# Altium project ElectrisenseAnalogConditioningBoard (Hank Herman's conflicted copy 2011-05-26).PrjPcb (part 5 of 5)
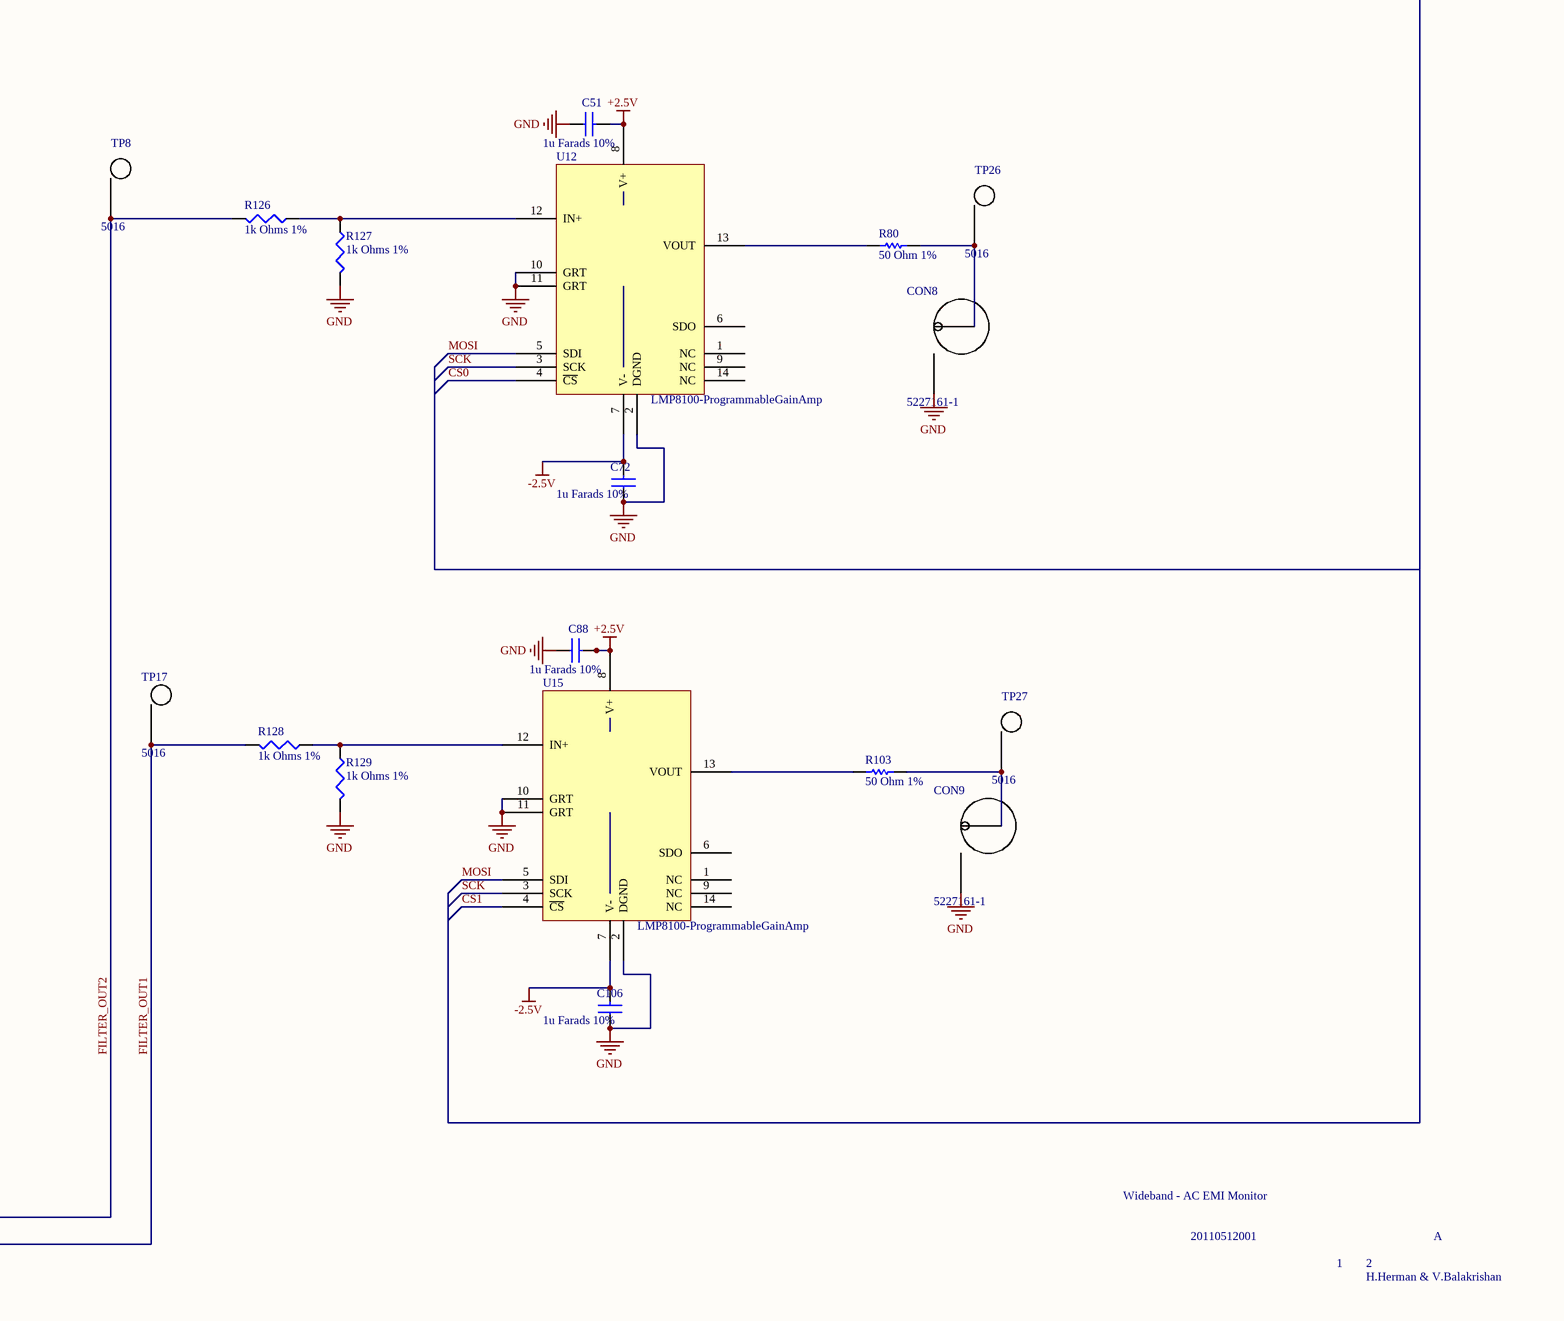
[diagram p10: ESense.SchDoc, bottom right]

## Sheet ESense.SchDoc (continued)

### Library data of the parts (continued)
R109 R111 = 2228: res thick film 0603 4.99k ohm 1% 1/10w ±100ppm/°c smd; mfrName: Panasonic; mfrPartNum: ERJ-3EKF4991V; Value: 1K; Extra_Description: RES 4.99K OHM 1/10W 1% 0603 SMD / Mounting Type: ``Surface Mount`` / Case / Package: ``0603`` / Packaging: ``Cut Tape (CT)`` / Lead-Free Status: ``Contains Lead`` / RoHS: ``Non-Compliant`` / Size-Width: { / ``uncertainty_minus``: null, / ``value``: 0.0008, / ``uncertainty_plus``: null / } / Resistance: { / ``uncertainty_minus``: null, / ``value``: 4990.0, / ``uncertainty_plus``: null / } / Size-Height: { / ``uncertainty_minus``: null, / ``value``: 0.00045, / ``uncertainty_plus``: null / } / Size-Length: { / ``uncertainty_minus``: null, / ``value``: 0.0016, / ``uncertainty_plus``: null / } / Resistance Tolerance: { / ``max_value``: 1.0, / ``max_uncertainty_plus``: null, / ``min_value``: -1.0, / ``min_uncertainty_plus``: null, / ``max_uncertainty_minus``: null / } / Operating Temperature: { / ``max_value``: 125.0, / ``max_uncertainty_plus``: null, / ``min_value``: null, / ``min_uncertainty_plus``: null, / ``max_uncertainty_minus``: null / }; Obsolete: False; Temp_Max: 0; TypeNotes: Applies to all parts in the database; Published: 8-Jun-2000; LatestRevisionDate: 17-Jul-2002; LatestRevisionNote: Re-released for DXP Platform.; PackageReference: AXIAL-0.3; Publisher: Altium Limited; PartID: 2228; URL_Image: http://cdn.sigma.octopart.com/8893006/image/Panasonic-ERJ-3EKF4991V.jpg; URL_Datasheet: http://datasheet.octopart.com/ERJ-3EKF4991V-Panasonic-datasheet-118621.pdf; Date_Created: 5/9/2011 1:33:57 PM; Date_LastModified: 5/9/2011 1:33:57 PM; Verified: False; RoHS: True; Temp_Min: 0; Type: All Parts
R112-R115 = 2226: resistor, rc22h 0603 1k5; power rating:0.1w;; mfrName: Yageo; mfrPartNum: RC0603FR-071K5L; Value: 1K; Extra_Description: RESISTOR, RC22H 0603 1K5; Power Rating:0.1W; Resistance:1.5kohm; Resistance Tolerance:± 1%; Series:RC22H; Operating Temperature Range:-55°C to +125°C; Resistor Element Type:Thick Film; Voltage Rating:50V dc; Temperature Coefficient:± 250ppm/°C; Case Style:0603; External Length / Height:1.6mm; Temperature Coeff. -:250ppm/°C; Tempperature Coeff. +:250ppm/°C; Tolerance, +:1%; Tolerance, -:1%; Voltage Rating DC:50V; External Depth:0.45mm; External Width:0.8mm; Full Power Rating Temperature:70°C; Max Operating Temperature:125°C; Min Temperature Operating:-55°C; Reel Quantity:5000; Termination Type:SMD; Lead Spacing:0.3mm; Resistor Case Style:0603 / Mounting Type: ``Surface Mount`` / Case / Package: ``0603`` / Packaging: ``Cut Tape (CT)`` / Lead-Free Status: ``Lead Free`` / RoHS: ``Compliant`` / Resistance: { / ``uncertainty_minus``: null, / ``value``: 1500.0, / ``uncertainty_plus``: null / } / Voltage Rating (DC): { / ``uncertainty_minus``: null, / ``value``: 50.0, / ``uncertainty_plus``: null / } / Size-Width: { / ``uncertainty_minus``: null, / ``value``: 0.0008, / ``uncertainty_plus``: null / } / Size-Length: { / ``uncertainty_minus``: null, / ``value``: 0.0016, / ``uncertainty_plus``: null / } / Size-Height: { / ``uncertainty_minus``: null, / ``value``: 0.00045, / ``uncertainty_plus``: null / } / Power Rating: { / ``uncertainty_minus``: null, / ``value``: 0.1, / ``uncertainty_plus``: null / } / Resistance Tolerance: { / ``max_value``: 1.0, / ``max_uncertainty_plus``: null, / ``min_value``: -1.0, / ``min_uncertainty_plus``: null, / ``max_uncertainty_minus``: null / } / Operating Temperature: { / ``max_value``: 155.0, / ``max_uncertainty_plus``: null, / ``min_value``: null, / ``min_uncertainty_plus``: null, / ``max_uncertainty_minus``: null / } / Number of Pins: 2; Obsolete: False; Temp_Max: 0; TypeNotes: Applies to all parts in the database; Published: 8-Jun-2000; LatestRevisionDate: 17-Jul-2002; LatestRevisionNote: Re-released for DXP Platform.; PackageReference: AXIAL-0.3; Publisher: Altium Limited; PartID: 2226; URL_Image: http://cdn.sigma.octopart.com/5320740/image/Yageo-RC0603FR-071K5L.jpg; URL_Datasheet: http://datasheet.octopart.com/RC0603FR-071K5L-Yageo-datasheet-8328172.pdf; Date_Created: 5/9/2011 1:11:38 PM; Date_LastModified: 5/9/2011 1:11:38 PM; Verified: False; RoHS: True; Temp_Min: 0; Type: All Parts
R118 R119 = 2229: res thick film 0603 8.87k ohm 1% 1/10w ±100ppm/°c molded smd; mfrName: Panasonic; mfrPartNum: ERJ-3EKF8871V; Value: 1K; Extra_Description: RES 8.87K OHM 1/10W 1% 0603 SMD / Mounting Type: ``Surface Mount`` / Case / Package: ``0603`` / Packaging: ``Cut Tape (CT)`` / Lead-Free Status: ``Lead Free`` / RoHS: ``Compliant`` / Size-Width: { / ``uncertainty_minus``: null, / ``value``: 0.0008, / ``uncertainty_plus``: null / } / Resistance: { / ``uncertainty_minus``: null, / ``value``: 8870.0, / ``uncertainty_plus``: null / } / Size-Height: { / ``uncertainty_minus``: null, / ``value``: 0.00045, / ``uncertainty_plus``: null / } / Size-Length: { / ``uncertainty_minus``: null, / ``value``: 0.0016, / ``uncertainty_plus``: null / } / Resistance Tolerance: { / ``max_value``: 1.0, / ``max_uncertainty_plus``: null, / ``min_value``: -1.0, / ``min_uncertainty_plus``: null, / ``max_uncertainty_minus``: null / } / Operating Temperature: { / ``max_value``: 125.0, / ``max_uncertainty_plus``: null, / ``min_value``: null, / ``min_uncertainty_plus``: null, / ``max_uncertainty_minus``: null / }; Obsolete: False; Temp_Max: 0; TypeNotes: Applies to all parts in the database; Published: 8-Jun-2000; LatestRevisionDate: 17-Jul-2002; LatestRevisionNote: Re-released for DXP Platform.; PackageReference: AXIAL-0.3; Publisher: Altium Limited; PartID: 2229; URL_Image: http://cdn.sigma.octopart.com/8893006/image/Panasonic-ERJ-3EKF8871V.jpg; URL_Datasheet: http://datasheet.octopart.com/ERJ-3EKF8871V-Panasonic-datasheet-118621.pdf; Date_Created: 5/9/2011 1:40:01 PM; Date_LastModified: 5/9/2011 1:40:01 PM; Verified: False; RoHS: True; Temp_Min: 0; Type: All Parts
S1 S2 = 2128: SW - SPST-NO - SM; mfrName: C&K Components; Extra_Description: PTS 525 Series / Microminiature Tact Switch for SMT; Obsolete: False; Temp_Max: 0; PartID: 2128; mfrPartNum: CKN9104CT-ND; mfrWebsite: http://digikey.com/Suppliers/us/C-and-K-Components.page?lang=EN; URL_Image: http://media.digikey.com/photos/CK%20Comp%20Photos/PTS525SM10SMTR.jpg; URL_Datasheet: http://www.ck-components.com/index.php?module=media&action=Display&cmpref=14407&lang=en&width=&height=&format=&alt=; Date_Created: 2/24/2011 10:42:02 PM; Date_LastModified: 2/24/2011 10:42:02 PM; Verified: False; RoHS: True; Temp_Min: 0; Type: Pushbutton (Push Button)
SW1 = 2235
TP1 TP2 TP2V5 TP3-TP5 TP5V TP6-TP35 TP-5V TP_-2V5 TP_CS0 TP_CS1 TP_F0-TP_F7 TP_GND TP_GND2 TP_MISO TP_MOSI TP_SCK TPSCL TPSDA = 2231: test point, connector; connector type:test; mounting type:pc; mfrName: Keystone; Extra_Description: Compact Surface Mount Test Points on Tape and Reel / Material: ``Phosphor Bronze`` / Packaging: ``Cut Tape (CT)`` / RoHS: ``Compliant`` / Mounting Type: ``Surface Mount`` / Lead-Free Status: ``Lead Free`` / Contact Material: ``Phosphor Bronze`` / Insulation Material: ``Polycarbonate`` / Size-Width: { / ``uncertainty_minus``: null, / ``value``: 0.001016, / ``uncertainty_plus``: null / } / Size-Length: { / ``uncertainty_minus``: null, / ``value``: 0.00381, / ``uncertainty_plus``: null / } / Size-Height: { / ``uncertainty_minus``: null, / ``value``: 0.002286, / ``uncertainty_plus``: null / }; Obsolete: False; Temp_Max: 0; TypeNotes: Applies to all parts in the database; PartID: 2231; mfrPartNum: 5016; mfrWebsite: http://www.keyelco.com/; URL_Image: http://cdn.sigma.octopart.com/9140493/image/Keystone-5016.jpg; URL_Datasheet: http://datasheet.octopart.com/5016-Keystone-datasheet-23674.pdf; Date_Created: 5/13/2011 7:38:09 AM; Date_LastModified: 5/13/2011 7:38:09 AM; Verified: False; RoHS: True; Temp_Min: 0; Type: All Parts
U1 = 2179: schottky diode; operating temperature range:0°c to +70°c;; mfrName: Comchip; Extra_Description: BRIDGE RECTIFIER 600V 2A DFS / 4 pin; Obsolete: False; Temp_Max: 0; TypeNotes: Applies to all parts in the database; PartID: 2179; mfrPartNum: DF206ST-G; URL_Image: http://media.digikey.com/Photos/Comchip%20Tech%20Photos/DF206ST-G_sml.jpg; URL_Datasheet: http://datasheet.octopart.com/UC3610DW-Texas-Instruments-datasheet-152804.pdf; Date_Created: 5/5/2011 3:08:22 AM; Date_LastModified: 5/5/2011 3:08:22 AM; Verified: False; RoHS: True; Temp_Min: 0; Type: All Parts
U2 U5 = 2192: op amp, r/r 200mhz single, soic8; no. of amplifiers:1; op amp; mfrName: Linear Technology; Extra_Description: Family	Linear - Amplifiers - Instrumentation, OP Amps, Buffer Amps / Series	- / Amplifier Type	General Purpose / Number of Circuits	1 / Output Type	Rail-to-Rail / Slew Rate	280 V/µs / Gain Bandwidth Product	720MHz / -3db Bandwidth	400MHz / Current - Input Bias	1.4µA / Voltage - Input Offset	100µV / Current - Supply	4.25mA / Current - Output / Channel	100mA / Voltage - Supply, Single/Dual (±)	2.5 V ~ 5.25 V, ±1.25 V ~ 2.625 V / Operating Temperature	-40°C ~ 125°C / Mounting Type	Surface Mount / Package / Case	SOT-23-6 Thin, TSOT-23-6 / Supplier Device Package	TSOT-23-6 / Packaging	Digi-Reel® / Other Names	LTC6252HS6#TRMPBFDKR / Alternate Package / This part is also available in the following packaging:; Obsolete: False; Temp_Max: 0; TypeNotes: Applies to all parts in the database; PartID: 2192; mfrPartNum: LTC6252; URL_Image: http://cds.linear.com/images/product/4358_pack_1.jpg; URL_Datasheet: http://datasheet.octopart.com/LTC6240CS8%23PBF-Linear-Technology-datasheet-502703.pdf; Date_Created: 5/5/2011 10:07:10 AM; Date_LastModified: 5/5/2011 10:07:10 AM; Verified: False; RoHS: True; Temp_Min: 0; Type: All Parts
U3 U7 U10 U11 U13 U14 U16 U17 = 2191: op amp, dual, r-r, 180mhz, 8msop; op amp type:unity gain; mfrName: Linear Technology; Extra_Description: OP AMP, DUAL, R-R, 180MHZ, 8MSOP; Op Amp Type:Unity Gain Stable; No. of Amplifiers:2; Bandwidth:180MHz; Slew Rate:90V/µs; Supply Voltage Range:2.5V to 5.25V; Amplifier Case Style:MSOP; No. of Pins:8; SVHC:No SVHC (15-Dec-2010); Base Number:6247; Operating Temperature Range:0°C to +70°C / RoHS: ``Compliant`` / Slew Rate: { / ``uncertainty_minus``: null, / ``value``: 90.0, / ``uncertainty_plus``: null / } / Number of Pins: 8; Obsolete: False; Temp_Max: 0; TypeNotes: Applies to all parts in the database; PartID: 2191; mfrPartNum: LTC6254CMS#PBF-ND; URL_Image: http://cds.linear.com/images/product/4358_pack_3.jpg; URL_Datasheet: http://datasheet.octopart.com/LTC6247CMS8%23PBF-Linear-Technology-datasheet-8712476.pdf; Date_Created: 5/5/2011 9:52:24 AM; Date_LastModified: 5/5/2011 9:52:24 AM; Verified: False; RoHS: True; Temp_Min: 0; Type: All Parts
U4 = 2209: switch, spdt dual, tssop14, 636; switch type, analogue:spdt;; mfrName: Analog Devices; Extra_Description: SWITCH, SPDT DUAL, TSSOP14, 636; Switch Type, Analogue:SPDT; Switches, No. of:2; Voltage, Supply Source:Dual; Resistance, On State:85ohm; Voltage, Supply Min:2.7V; Voltage, Supply Max:5.5V; Termination Type:SMD; Case Style:TSSOP; No. of Pins:14; Operating Temperature Range:-40°C to +125°C; Base Number:636 / Mounting Type: ``Surface Mount`` / Case / Package: ``TSSOP-14`` / Packaging: ``Bulk`` / Lead-Free Status: ``Lead Free`` / RoHS: ``Compliant`` / Rds [Drain to Source Resistance] (on): { / ``uncertainty_minus``: null, / ``value``: 85.0, / ``uncertainty_plus``: null / } / Supply Voltage (DC): { / ``max_value``: 5.5, / ``max_uncertainty_plus``: null, / ``min_value``: null, / ``min_uncertainty_plus``: null, / ``max_uncertainty_minus``: null / } / Number of Channels: 2 / Number of Pins: 14; Obsolete: False; Temp_Max: 0; TypeNotes: Applies to all parts in the database; PartID: 2209; mfrPartNum: ADG636YRUZ; URL_Image: http://cdn.sigma.octopart.com/8900696/image/Analog-Devices-ADG636YRUZ.jpg; URL_Datasheet: http://datasheet.octopart.com/ADG636YRUZ-Analog-Devices-datasheet-11285.pdf; Date_Created: 5/8/2011 10:47:40 AM; Date_LastModified: 5/8/2011 10:47:40 AM; Verified: False; RoHS: True; Temp_Min: 0; Type: All Parts
U6 = 2175: mcu, 8bit, avr, 32k flash, usb, 44tqfp; eeprom memory; mfrName: Atmel; Extra_Description: MCU, 8BIT, AVR, 32K FLASH, USB, 44TQFP; EEPROM Memory Size:1KB; RAM Memory Size:2.5KB; No. of Timers:5; No. of PWM Channels:14; Operating Temperature Range:-40°C to +85°C; No. of Pins:44; Case Style:TQFP; Clock Frequency:16MHz; Flash Memory Size:32KB; Interface Type:I2C, JTAG, SPI, USART, USB; Logic Function Number:32; Max Supply Voltage:5.5V; Min Supply Voltage:2.7V; No. of ADC Inputs:12; No. of I/O Lines:26; Series:ATMEGA; Termination Type:SMD / RoHS: ``Compliant`` / Clock Speed: { / ``uncertainty_minus``: null, / ``value``: 16000000.0, / ``uncertainty_plus``: null / } / Number of Pins: 44; Obsolete: False; Temp_Max: 0; TypeNotes: Applies to all parts in the database; PartID: 2175; mfrPartNum: ATMEGA32U4-AU; URL_Image: http://cdn.sigma.octopart.com/8899375/image/Atmel-ATMEGA32U4-AU.jpg; URL_Datasheet: http://datasheet.octopart.com/ATMEGA32U4-AU-Atmel-datasheet-8370675.pdf; Date_Created: 5/4/2011 9:48:10 PM; Date_LastModified: 5/4/2011 9:48:10 PM; Verified: False; RoHS: True; Temp_Min: 0; Type: All Parts
U8 U9 = 2234: ic quad 2-in mux 16-ssop; mfrName: NXP Semiconductors; Obsolete: False; Temp_Max: 0; TypeNotes: Applies to all parts in the database; PartID: 2234; Extra_Description: IC QUAD 2-IN MUX 16-SSOP; mfrPartNum: 74HC157DB,112; URL_Image: http://cdn.sigma.octopart.com/8893211/image/NXP-Semiconductors-74HC157DB%2C112.jpg; URL_Datasheet: http://www.nxp.com/documents/data_sheet/74HC_HCT157.pdf; Date_Created: 5/13/2011 11:15:44 PM; Date_LastModified: 5/13/2011 11:15:44 PM; Verified: False; RoHS: True; Temp_Min: 0; Type: All Parts
U12 U15 = 2236
U18 U19 = 2230: mux, 8-ch, smd, tssop16, 658; analogue multiplexer; mfrName: Analog Devices; Extra_Description: IC, ANALOG MULTIPLEXER, 8 X 1, TSSOP-16; On State Resistance Max:45ohm; Operating Temperature Range:-40°C to +125°C; Analog Switch Case Style:TSSOP; No. of Pins:16; Multiplexer Configuration:8:1; Package/Case:16-TSSOP ;RoHS Compliant: Yes / Mounting Type: ``Surface Mount`` / Case / Package: ``TSSOP-16`` / Packaging: ``Bulk`` / Lead-Free Status: ``Lead Free`` / RoHS: ``Compliant`` / Rds [Drain to Source Resistance] (on): { / ``uncertainty_minus``: null, / ``value``: 45.0, / ``uncertainty_plus``: null / } / Operating Temperature: { / ``max_value``: 125.0, / ``max_uncertainty_plus``: null, / ``min_value``: null, / ``min_uncertainty_plus``: null, / ``max_uncertainty_minus``: null / } / Supply Voltage (DC): { / ``max_value``: 12.0, / ``max_uncertainty_plus``: null, / ``min_value``: null, / ``min_uncertainty_plus``: null, / ``max_uncertainty_minus``: null / } / Number of Channels: 8 / Number of Circuits: 1 / Number of Pins: 16; Obsolete: False; Temp_Max: 0; TypeNotes: Applies to all parts in the database; PartID: 2230; mfrPartNum: ADG658YRUZ; URL_Image: http://cdn.sigma.octopart.com/8892481/image/Analog-Devices-ADG658YRUZ.jpg; URL_Datasheet: http://datasheet.octopart.com/ADG658YRUZ-Analog-Devices-datasheet-7606323.pdf; Date_Created: 5/13/2011 5:38:05 AM; Date_LastModified: 5/13/2011 5:38:05 AM; Verified: False; RoHS: True; Temp_Min: 0; Type: All Parts
VR1 VR2 = 2181: v reg, linear, 37v, smd; voltage regulator type:adjustable; mfrName: National Semiconductor; Extra_Description: V REG, LINEAR, 37V, SMD; Voltage Regulator Type:Adjustable Positive; Voltage, Input Max:40V; Voltage, Output Max:37V; Max Output Current:1.5A; No. of Outputs:1; Voltage, Output Adjustable Max:37V; Voltage, Output Adjustable Min:1.2V; Voltage, Supply Min:3V; Voltage, Supply Max:40V; Termination Type:SMD; Case Style:SOT-223; No. of Pins:4; Operating Temperature Range:0°C to +125°C / Mounting Type: ``Surface Mount`` / Lead-Free Status: ``Contains Lead`` / Packaging: ``Cut Tape (CT)`` / RoHS: ``Compliant`` / Current Rating: { / ``uncertainty_minus``: null, / ``value``: 1.0, / ``uncertainty_plus``: null / } / Output Current: { / ``uncertainty_minus``: null, / ``value``: 1.0, / ``uncertainty_plus``: null / } / Operating Temperature: { / ``max_value``: 125.0, / ``max_uncertainty_plus``: null, / ``min_value``: null, / ``min_uncertainty_plus``: null, / ``max_uncertainty_minus``: null / } / Output Voltage: { / ``max_value``: null, / ``max_uncertainty_plus``: null, / ``min_value``: 1.2, / ``min_uncertainty_plus``: null, / ``max_uncertainty_minus``: null / } / Supply Voltage (DC): { / ``max_value``: 40.0, / ``max_uncertainty_plus``: null, / ``min_value``: null, / ``min_uncertainty_plus``: null, / ``max_uncertainty_minus``: null / } / Number of Outputs: 1 / Number of Pins: 4; Obsolete: False; Temp_Max: 0; TypeNotes: Applies to all parts in the database; PartID: 2181; mfrPartNum: LM317EMP/NOPB; URL_Image: http://cdn.sigma.octopart.com/9036263/image/National-Semiconductor-LM317EMP/NOPB.jpg; URL_Datasheet: http://datasheet.octopart.com/LM317EMP/NOPB-National-Semiconductor-datasheet-124580.pdf; Date_Created: 5/5/2011 3:47:18 AM; Date_LastModified: 5/5/2011 3:47:18 AM; Verified: False; RoHS: True; Temp_Min: 0; Type: All Parts
VR3 VR4 = 2183: linear voltage regulator ic; output voltage adjustable; mfrName: National Semiconductor; Extra_Description: Linear Voltage Regulator IC; Output Voltage Adjustable Range:-1.2V to -37V; Output Current:1A; No. of Outputs:1; No. of Pins:3; Operating Temperature Range:-40°C to +125°C; Leaded Process Compatible:Yes; Output Current Max:1.5A ;RoHS Compliant: Yes / Mounting Type: ``Surface Mount`` / Case / Package: ``SOT-223`` / Packaging: ``Cut Tape (CT)`` / Lead-Free Status: ``Lead Free`` / RoHS: ``Compliant`` / Output Current: { / ``uncertainty_minus``: null, / ``value``: 1.5, / ``uncertainty_plus``: null / } / Operating Temperature: { / ``max_value``: 150.0, / ``max_uncertainty_plus``: null, / ``min_value``: null, / ``min_uncertainty_plus``: null, / ``max_uncertainty_minus``: null / } / Number of Pins: 3; Obsolete: False; Temp_Max: 0; TypeNotes: Applies to all parts in the database; PartID: 2183; mfrPartNum: LM337IMP/NOPB; URL_Image: http://cdn.sigma.octopart.com/9036263/image/National-Semiconductor-LM337IMP/NOPB.jpg; URL_Datasheet: http://datasheet.octopart.com/LM337IMP/NOPB-National-Semiconductor-datasheet-10977.pdf; Date_Created: 5/5/2011 4:18:00 AM; Date_LastModified: 5/5/2011 4:18:00 AM; Verified: False; RoHS: True; Temp_Min: 0; Type: All Parts
X1 = 2197: transformers 12.6vct @ 2.40a 6.3v @ 4.80a; mfrName: Tamura; Extra_Description: TRANSF LO PRO DUAL 6.3VAC 4.8A / Mounting Type: ``Through Hole`` / Lead-Free Status: ``Lead Free`` / Packaging: ``Bulk`` / RoHS: ``Compliant`` / Power Rating: { / ``uncertainty_minus``: null, / ``value``: 30.0, / ``uncertainty_plus``: null / } / Size-Length: { / ``uncertainty_minus``: null, / ``value``: 0.066675, / ``uncertainty_plus``: null / } / Size-Height: { / ``uncertainty_minus``: null, / ``value``: 0.0397, / ``uncertainty_plus``: null / } / Weight: { / ``uncertainty_minus``: null, / ``value``: 521.631, / ``uncertainty_plus``: null / } / Size-Width: { / ``uncertainty_minus``: null, / ``value``: 0.055575, / ``uncertainty_plus``: null / } / Frequency: { / ``max_value``: 60.0, / ``max_uncertainty_plus``: null, / ``min_value``: null, / ``min_uncertainty_plus``: null, / ``max_uncertainty_minus``: null / } / Output Power: { / ``max_value``: 30.0, / ``max_uncertainty_plus``: null, / ``min_value``: null, / ``min_uncertainty_plus``: null, / ``max_uncertainty_minus``: null / }; Obsolete: False; Temp_Max: 0; TypeNotes: Applies to all parts in the database; PartID: 2197; mfrPartNum: PL30-12-130B; URL_Image: http://cdn.sigma.octopart.com/9086040/image/Tamura-PL30-12-130B.jpg; URL_Datasheet: http://datasheet.octopart.com/PL30-12-130B-Tamura-datasheet-32611.pdf; Date_Created: 5/7/2011 2:03:49 AM; Date_LastModified: 5/7/2011 2:03:49 AM; Verified: False; RoHS: True; Temp_Min: 0; Type: All Parts
Y1 = 1075: CRYSTAL 16.00MHZ 20PF SMD; mfrName: ECS Inc; mfrPartNum: ECS-160-20-5P-TR; Extra_Description: ECS Inc / Frequency16.000MHz / Load Capacitance20pF / Package / CaseSurface Mount (smd-smt) / PackagingCut Tape (CT) / Other NamesECS-160-20-5P / XC694CT; PartID: 1075; URL_Datasheet: http://www.digikey.com/scripts/DkSearch/dksus.dll?Pname?Name=xc694ct-nd&Site=US; Date_Created: 6/11/2005 10:42:52 PM; Date_LastModified: 8/21/2009 1:12:54 AM; Verified: False; Type: Crystals